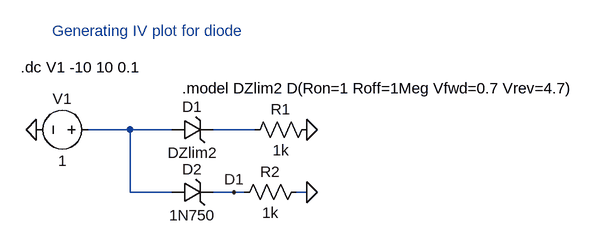
[diagram p0: schematic diode_test.asc]
diode_test.asc, the LTspice schematic file:
Version 4
SHEET 1 1112 680
WIRE 368 240 304 240
WIRE 432 240 368 240
WIRE 560 240 496 240
WIRE 368 336 368 240
WIRE 432 336 368 336
WIRE 528 336 496 336
WIRE 544 336 528 336
WIRE 640 336 624 336
FLAG 640 240 0
FLAG 224 240 0
FLAG 640 336 0
FLAG 528 336 D1
SYMBOL zener 432 256 R270
WINDOW 0 36 32 VTop 2
WINDOW 3 -4 32 VBottom 2
SYMATTR InstName D1
SYMATTR Value DZlim2
SYMBOL res 656 224 R90
WINDOW 0 0 56 VBottom 2
WINDOW 3 32 56 VTop 2
SYMATTR InstName R1
SYMATTR Value 1k
SYMBOL voltage 320 240 R90
WINDOW 0 -32 56 VBottom 2
WINDOW 3 32 56 VTop 2
SYMATTR InstName V1
SYMATTR Value 1
SYMBOL zener 432 352 R270
WINDOW 0 36 32 VTop 2
WINDOW 3 -4 32 VBottom 2
SYMATTR InstName D2
SYMATTR Value 1N750
SYMBOL res 640 320 R90
WINDOW 0 0 56 VBottom 2
WINDOW 3 32 56 VTop 2
SYMATTR InstName R2
SYMATTR Value 1k
TEXT 448 176 Left 2 !.model DZlim2 D(Ron=1 Roff=1Meg Vfwd=0.7 Vrev=4.7)
TEXT 200 144 Left 2 !.dc V1 -10 10 0.1
TEXT 248 88 Left 2 ;Generating IV plot for diode

The netlist it stands for:
* diode_test.asc
D1 N001 N002 DZlim2
R1 0 N002 1k
V1 N001 0 1
D2 N001 D1 1N750
R2 0 D1 1k
.model D D
.lib standard.dio
.model DZlim2 D(Ron=1 Roff=1Meg Vfwd=0.7 Vrev=4.7)
.dc V1 -10 10 0.1
* Generating IV plot for diode
.backanno
.end